# EAGLE design RCM-Comm_v3_E (EAGLE 9.3.1)
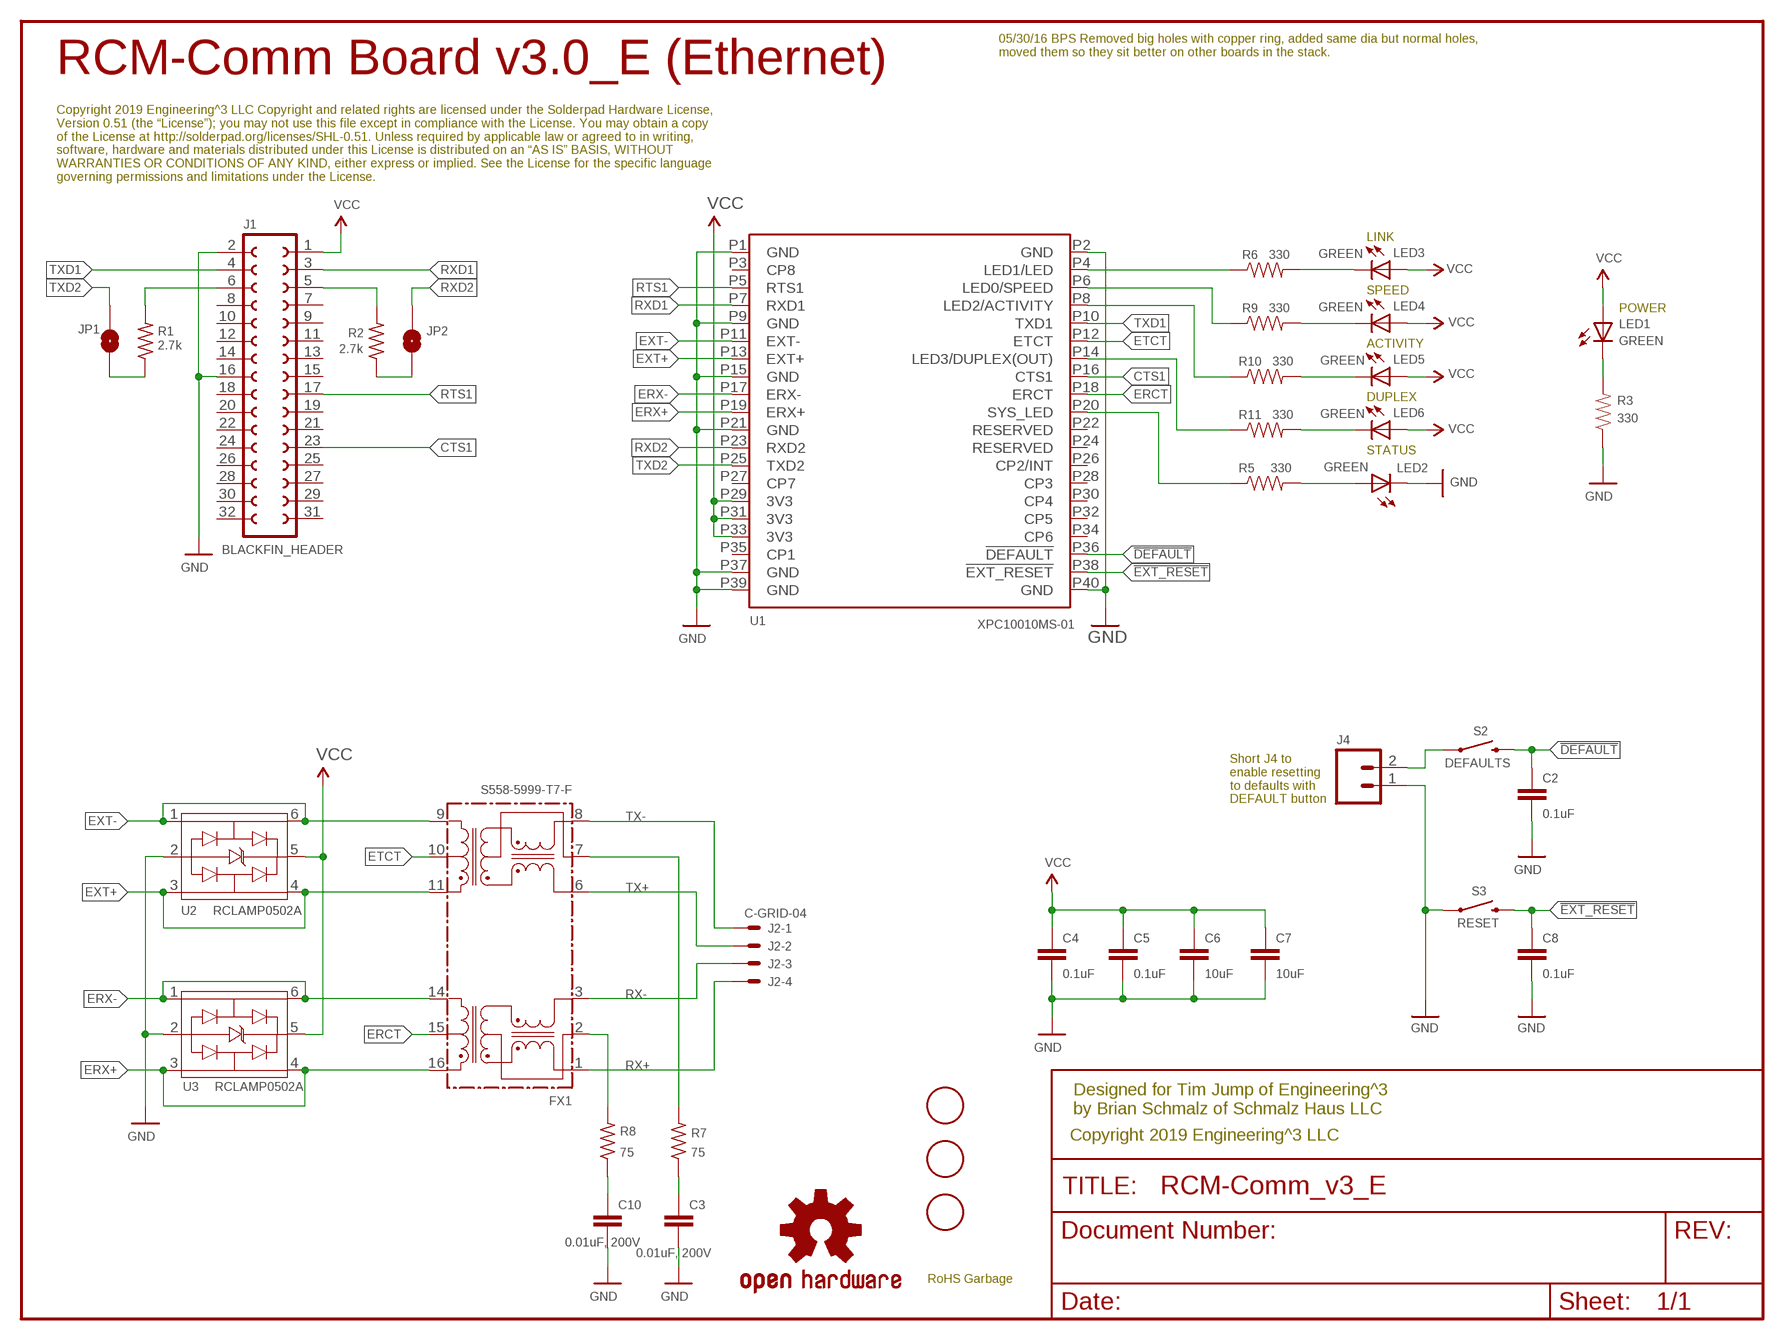
[diagram p0: schematic, sheet 1]

## Parts
C2  0.1uF  0.1UF-25V(+80/-20%)(0603)  [0603-CAP]
C3  0.01uF, 200V  CAP0603-CAP  [0603-CAP]
C4  0.1uF  0.1UF-25V(+80/-20%)(0603)  [0603-CAP]
C5  0.1uF  0.1UF-25V(+80/-20%)(0603)  [0603-CAP]
C6  10uF  10UF-6.3V-20%(0603)  [0603-CAP]
C7  10uF  10UF-6.3V-20%(0603)  [0603-CAP]
C8  0.1uF  0.1UF-25V(+80/-20%)(0603)  [0603-CAP]
C10  0.01uF, 200V  CAP0603-CAP  [0603-CAP]
FID1  FIDUCIAL  [FIDUCIAL_1MM]
FID2  FIDUCIAL  [FIDUCIAL_1MM]
FID3  FIDUCIAL  [FIDUCIAL_1MM]
FX1  S558-5999-T7-F  TG110-E050N5  [N5]
J1  BLACKFIN_HEADER  [2X16]
J2-  C-GRID-04  [70555-04]
J4  M02LOCK  [1X02_LOCK]
JP1  JUMPER-PAD-2-NOROUND  [PAD-JUMPER-2-NO_YES_SILK_ROUND]
JP2  JUMPER-PAD-2-NOROUND  [PAD-JUMPER-2-NO_YES_SILK_ROUND]
LED1  GREEN  LED0603  [LED-0603]
LED2  GREEN  LED0603  [LED-0603]
LED3  GREEN  LED0603  [LED-0603]
LED4  GREEN  LED0603  [LED-0603]
LED5  GREEN  LED0603  [LED-0603]
LED6  GREEN  LED0603  [LED-0603]
LOGO1  OSHW-LOGOM  [OSHW-LOGO-M]
R1  2.7k  R-US_R0603  [R0603]
R2  2.7k  R-US_R0603  [R0603]
R3  330  RESISTOR0603-RES  [0603-RES]
R5  330  RESISTOR0603-RES  [0603-RES]
R6  330  RESISTOR0603-RES  [0603-RES]
R7  75  R-US_R0603  [R0603]
R8  75  R-US_R0603  [R0603]
R9  330  RESISTOR0603-RES  [0603-RES]
R10  330  RESISTOR0603-RES  [0603-RES]
R11  330  RESISTOR0603-RES  [0603-RES]
S2  DEFAULTS  SWITCH-MOMENTARY-2SMD  [TACTILE-SWITCH-SMD]
S3  RESET  SWITCH-MOMENTARY-2SMD  [TACTILE-SWITCH-SMD]
U1  XPC10010MS-01  LANTRONIX_XPICO  [LANTRONIX_XPICO]
U2  RCLAMP0502A  [SC-89]
U3  RCLAMP0502A  [SC-89]
U$3  ROHS_GARBAGE  [ROHS_GARBAGE_5MM]

## Nets
!DEFAULT!: C2.1 S2.3 U1.P36(!DEFAULT!)
!EXT_RESET!: C8.1 S3.3 U1.P38(!EXT_RESET!)
CTS1: J1.23(GP6) U1.P16(CTS1)
ERCT: FX1.15 U1.P18(ERCT)
ERX+: FX1.16 U1.P19(ERX+) U3.3 U3.4
ERX-: FX1.14 U1.P17(ERX-) U3.1 U3.6
ETCT: FX1.10 U1.P12(ETCT)
EXT+: FX1.11 U1.P13(EXT+) U2.3 U2.4
EXT-: FX1.9 U1.P11(EXT-) U2.1 U2.6
GND: C2.2 C3.2 C4.2 C5.2 C6.2 C7.2 C8.2 C10.2 J1.2(GND) J1.16(GND16) J4.1 LED2.C R3.1 S3.1 U1.P1(GND) U1.P2(GND) U1.P9(GND) U1.P15(GND) U1.P21(GND) U1.P37(GND) U1.P39(GND) U1.P40(GND) U2.2 U3.2
LED0_SPEED: R9.1 U1.P6(LED0/SPEED)
LED1_LINK: R6.1 U1.P4(LED1/LED)
LED2_ACTIVITY: R10.1 U1.P8(LED2/ACTIVITY)
LED3_DUPLEX: R11.1 U1.P14(LED3/DUPLEX(OUT))
N$1: J4.2 S2.1
N$2: JP1.2 R1.1
N$3: LED1.C R3.2
N$4: JP2.1 R2.1
N$6: LED2.A R5.2
N$7: FX1.2 R8.2
N$8: LED3.C R6.2
N$9: C10.1 R8.1
N$10: C3.1 R7.1
N$11: FX1.7 R7.2
N$14: LED6.C R11.2
N$15: LED5.C R10.2
N$16: LED4.C R9.2
RTS1: J1.17(GP0) U1.P5(RTS1)
RX+: FX1.1 J2-.4
RX-: FX1.3 J2-.3
RXD1: J1.3(TX0) U1.P7(RXD1)
RXD2: JP2.2 U1.P23(RXD2)
RXD2_J1: J1.5(TX1) R2.2
SYSTEM_LED: R5.1 U1.P20(SYS_LED)
TX+: FX1.6 J2-.2
TX-: FX1.8 J2-.1
TXD1: J1.4(RX0) U1.P10(TXD1)
TXD2: JP1.1 U1.P25(TXD2)
TXD2_J1: J1.6(RX1) R1.2
VCC: C4.1 C5.1 C6.1 C7.1 J1.1(3.3V) LED1.A LED3.A LED4.A LED5.A LED6.A U1.P29(3V3) U1.P31(3V3) U1.P33(3V3) U2.5 U3.5
Unconnected: J1.7(TMR2) J1.8(TMR3) J1.9(SPI_MOSI) J1.10(SPI_MISO) J1.11(SPI_SCK) J1.12(SPI_SEL) J1.13(SPI_SEL2) J1.14(SPI_SCL) J1.15(I2C_SDA) J1.18(GP1) J1.19(GP2) J1.20(GP3) J1.21(GP4) J1.22(GP5) J1.24(GP7) J1.25(GP8) J1.26(GP9) J1.27(GPA) J1.28(GPB) J1.29(GPC) J1.30(GPD) J1.31(GPE) J1.32(GPF) U1.P3(CP8) U1.P22(RESERVED) U1.P24(RESERVED) U1.P26(CP2/INT) U1.P27(CP7) U1.P28(CP3) U1.P30(CP4) U1.P32(CP5) U1.P34(CP6) U1.P35(CP1)

## Notes on the sheet
- 05/30/16 BPS Removed big holes with copper ring, added same dia but normal holes, 
  moved them so they sit better on other boards in the stack.
- RCM-Comm Board v3.0_E (Ethernet)
- Copyright 2019 Engineering^3 LLC Copyright and related rights are licensed under the Solderpad Hardware License, 
  Version 0.51 (the “License”); you may not use this file except in compliance with the License. You may obtain a copy 
  of the License at http://solderpad.org/licenses/SHL-0.51. Unless required by applicable law or agreed to in writing, 
  software, hardware and materials distributed under this License is distributed on an “AS IS” BASIS, WITHOUT 
  WARRANTIES OR CONDITIONS OF ANY KIND, either express or implied. See the License for the specific language 
  governing permissions and limitations under the License.
- LINK
- SPEED
- POWER
- ACTIVITY
- DUPLEX
- STATUS
- Short J4 to
  enable resetting
  to defaults with 
  DEFAULT button
- Designed for Tim Jump of Engineering^3
  by Brian Schmalz of Schmalz Haus LLC
- Copyright 2019 Engineering^3 LLC

## Library data of the parts
C2 C4 C5 C8 = SparkFun-Capacitors:0.1UF-25V(+80/-20%)(0603): CAP-00810 Ceramic Standard decoupling cap; PROD_ID: CAP-00810
C3 C10 = spark_fun:CAP: Capacitor Standard 0603 ceramic capacitor, and 0.1" leaded capacitor.
C6 C7 = SparkFun-Capacitors:10UF-6.3V-20%(0603): CAP-11015; PROD_ID: CAP-11015
FID1-FID3 = adafruit:FIDUCIAL: For use by pick and place machines to calibrate the vision/machine, 1mm By microbuilder.eu
FX1 = halo-electronics:TG110-E050N5: E-Ultra (TM) 10/100BASE-TX SOIC-16 Fast Ethernet Magnetic Modules Source: www.haloelectronics.com .. e-ultra.pdf
J1 = Surveyor:BLACKFIN_HEADER
J2- = MolexConnector:C-GRID-04
J4 = SparkFun-Connectors:M02: Standard 2-pin 0.1" header. Use with - straight break away headers ( PRT-00116) - right angle break away headers (PRT-00553) - swiss pins (PRT-00743) - machine pins (PRT-00117) - female headers (PRT-00115) Molex polarized connector foot print use with: PRT-08233 with associated crimp pins and housings. 2.54_SCREWTERM for use with PRT-10571. 3.5mm Screw Terminal footprints for PRT-08084 5mm Screw Terminal footprints for use with PRT-08432
JP1 JP2 = SparkFun-Passives:JUMPER-PAD-2-NO
LED1-LED6 = spark_fun:LED: LEDs Standard schematic elements and footprints for 5mm, 3mm, 1206, and 0603 sized LEDs. 5mm - Spark Fun Electronics SKU : COM-00529 (and others)
LOGO1 = SparkFun-Aesthetics:OSHW-LOGO: Open Source Hardware Logo This logo indicates the piece of hardware it is found on incorporates a OSHW license and/or adheres to the definition of open source hardware found here: http://freedomdefined.org/OSHW
R1 R2 R7 R8 = rcl:R-US_: RESISTOR, American symbol
R3 R5 R6 R9-R11 = spark_fun:RESISTOR: Resistor Basic schematic elements and footprints for 0603, 1206, and PTH resistors.
S2 S3 = SparkFun-Electromechanical:SWITCH-MOMENTARY-2: Various NO switches- pushbuttons, reed, etc; PROD_ID: SWCH-08247
U1 = xPicoEthernet:LANTRONIX_XPICO
U2 U3 = SemtechRCLAMP:RCLAMP0502A
U$3 = SchmalzHausPublic:ROHS_GARBAGE

## Board
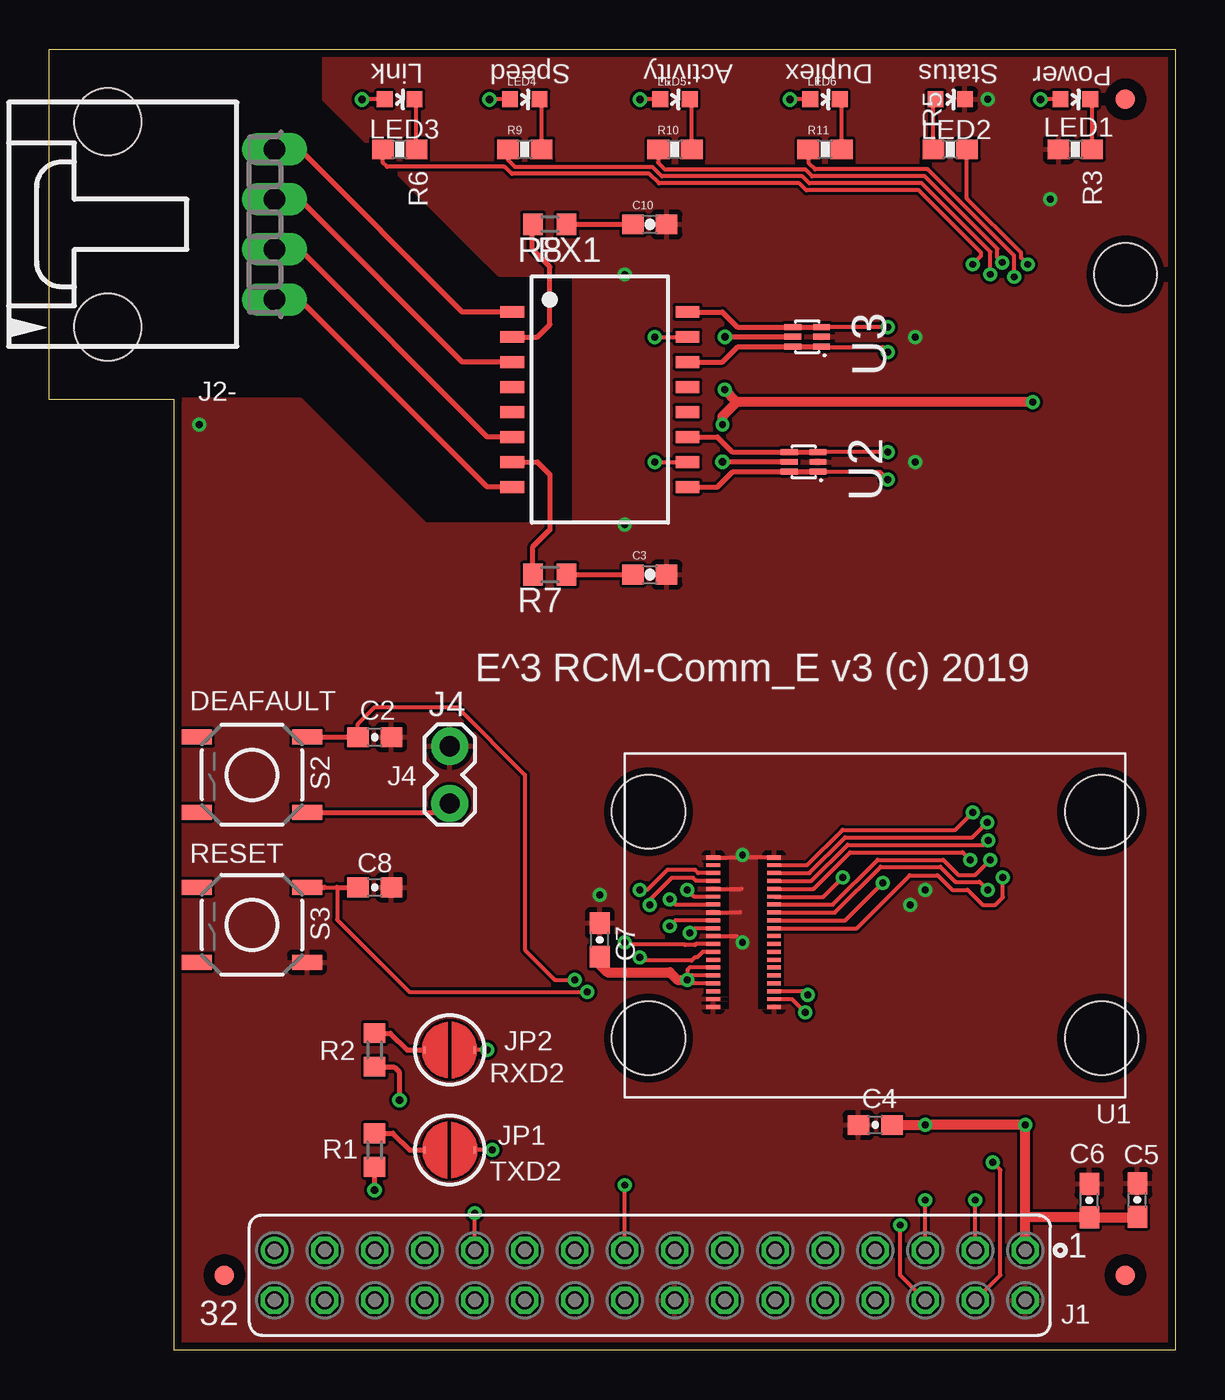
[diagram p1: board, top side]
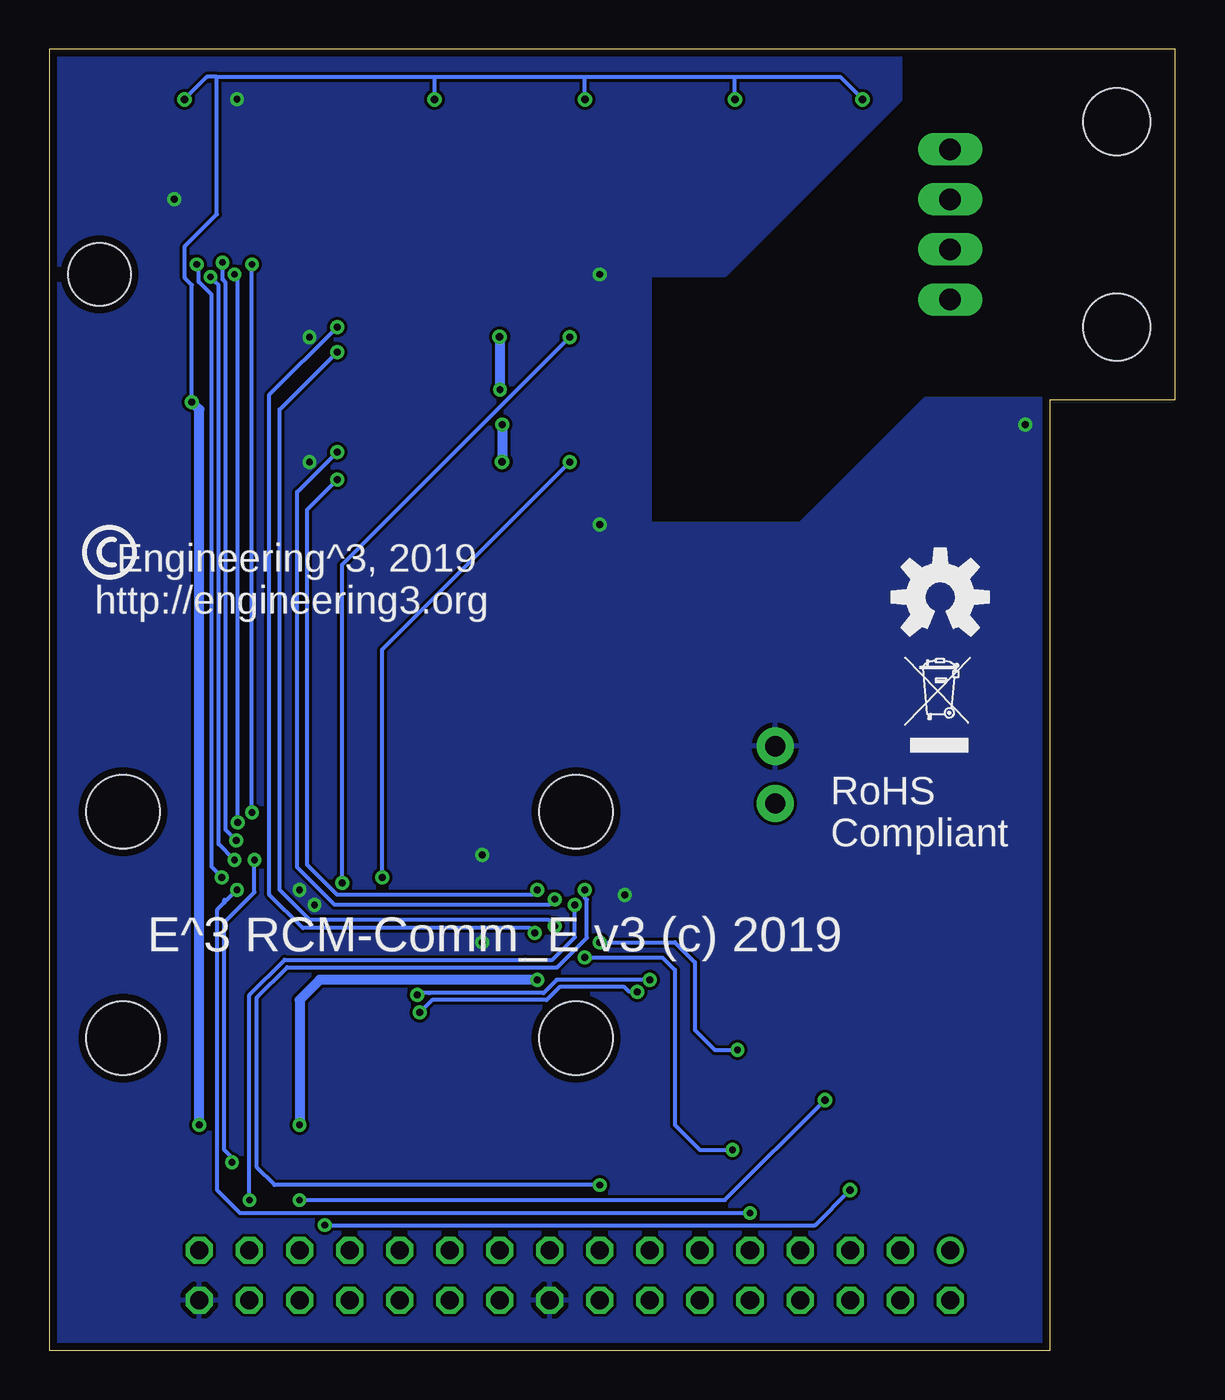
[diagram p2: board, bottom side, seen from below]

Size 57.15 x 66.05 mm. Coordinates in mm from the lower left corner, seen from the top.
Outline: 0,66.05 57.15,66.05 57.15,43.69 57.15,0 6.35,0.01 6.35,48.27 0,48.27 0,66.05
Copper layers (1*16): Top 0.0356mm / dielectric 1.5011mm / Bottom 0.0356mm
Design rules "LaenPCBOrder": minimum track width 6mil, minimum drill 13mil, track to track 6mil, track to pad 6mil, pad to pad 6mil, via to via 6mil, smd to smd 6mil, copper to edge 15mil, drill to drill 6mil, minimum pad ring 7mil, minimum via ring 7mil, stop-mask expansion 3mil, vias tented up to drill 25mil, thermal gap 10mil
Holes 3.17 mm at 54.61,54.62

### Footprints (pad centres in the part's own frame; a part is rotated, then mirrored left to right if it is on the bottom)
0603-CAP = smd 1.1 x 1: 1 -0.85,0; 2 0.85,0
FIDUCIAL_1MM = smd 1 x 1: 1 0,0
N5 = smd 0.6 x 1.2: 1 -4.445,-4.445; 2 -3.175,-4.445; 3 -1.905,-4.445; 4 -0.635,-4.445; 5 0.635,-4.445; 6 1.905,-4.445; 7 3.175,-4.445; 8 4.445,-4.445; 9 4.445,4.445; 10 3.175,4.445; 11 1.905,4.445; 12 0.635,4.445; 13 -0.635,4.445; 14 -1.905,4.445; 15 -3.175,4.445; 16 -4.445,4.445
2X16 = drill 0.914 octagon: 1 20.32,1.27; 2 20.32,-1.27; 3 17.78,1.27; 4 17.78,-1.27; 5 15.24,1.27; 6 15.24,-1.27; 7 12.7,1.27; 8 12.7,-1.27; 9 10.16,1.27; 10 10.16,-1.27; 11 7.62,1.27; 12 7.62,-1.27; 13 5.08,1.27; 14 5.08,-1.27; 15 2.54,1.27; 16 2.54,-1.27; 17 0,1.27; 18 0,-1.27; 19 -2.54,1.27; 20 -2.54,-1.27; 21 -5.08,1.27; 22 -5.08,-1.27; 23 -7.62,1.27; 24 -7.62,-1.27; 25 -10.16,1.27; 26 -10.16,-1.27; 27 -12.7,1.27; 28 -12.7,-1.27; 29 -15.24,1.27; 30 -15.24,-1.27; 32 -17.78,-1.27 | drill 0.914: 31 -17.78,1.27
70555-04 = drill 1.092 long: 1 -3.81,0; 2 -1.27,0; 3 1.27,0; 4 3.81,0 | hole 3.404: -5.207,8.458; 5.207,8.458
1X02_LOCK = drill 1.016 pad 1.88: 1 -0.178,0; 2 2.718,0
PAD-JUMPER-2-NO_YES_SILK_ROUND = smd 0.152 x 0.305: 1 -1.27,0; 2 1.27,0
LED-0603 = smd 0.8 x 0.8: A 0,-0.75; C 0,0.75
R0603 = smd 1 x 1.1: 1 -0.85,0; 2 0.85,0
0603-RES = smd 1.1 x 1: 1 -0.85,0; 2 0.85,0
TACTILE-SWITCH-SMD = smd 1.524 x 0.762: 1 -2.794,1.905; 2 2.794,1.905; 3 -2.794,-1.905; 4 2.794,-1.905
LANTRONIX_XPICO = smd 0.7 x 0.2: P1 -8.21,3.43; P2 -5.13,3.43; P3 -8.21,3.03; P4 -5.13,3.03; P5 -8.21,2.63; P6 -5.13,2.63; P7 -8.21,2.23; P8 -5.13,2.23; P9 -8.21,1.83; P10 -5.13,1.83; P11 -8.21,1.43; P12 -5.13,1.43; P13 -8.21,1.03; P14 -5.13,1.03; P15 -8.21,0.63; P16 -5.13,0.63; P17 -8.21,0.23; P18 -5.13,0.23; P19 -8.21,-0.17; P20 -5.13,-0.17; P21 -8.21,-0.57; P22 -5.13,-0.57; P23 -8.21,-0.97; P24 -5.13,-0.97; P25 -8.21,-1.37; P26 -5.13,-1.37; P27 -8.21,-1.77; P28 -5.13,-1.77; P29 -8.21,-2.17; P30 -5.13,-2.17; P31 -8.21,-2.57; P32 -5.13,-2.57; P33 -8.21,-2.97; P34 -5.13,-2.97; P35 -8.21,-3.37; P36 -5.13,-3.37; P37 -8.21,-3.77; P38 -5.13,-3.77; P39 -8.21,-4.17; P40 -5.13,-4.17 | hole 3.73: -11.5,5.75; -11.5,-5.75; 11.5,5.75; 11.5,-5.75
SC-89 = smd 0.3 x 0.85: 1 -0.5,-0.725; 2 0,-0.725; 3 0.5,-0.725; 4 0.5,0.725; 5 0,0.725; 6 -0.5,0.725

### Placement (x,y rotation side)
C2  16.51,31.12 0 top
C3  30.48,39.38 0 top
C4  41.91,11.44 180 top
C5  55.22,7.62 90 top
C6  52.78,7.6 90 top
C7  27.94,20.83 90 top
C8  16.51,23.5 0 top
C10  30.48,57.16 0 top
FID1  8.89,3.81 0 top
FID2  54.61,63.51 0 top
FID3  54.61,3.81 0 top
FX1  27.94,48.27 270 top
J1  29.21,3.81 0 top
J2-  11.43,57.16 90 top
J4  20.32,30.48 270 top
JP1  20.32,10.17 180 top
JP2  20.32,15.25 0 top
LED1  52.07,63.51 270 top
LED2  45.72,63.51 270 top
LED3  17.78,63.51 270 top
LED4  24.13,63.51 270 top
LED5  31.75,63.51 270 top
LED6  39.37,63.51 270 top
LOGO1  11.94,38.23 0 bottom
R1  16.51,10.17 270 top
R2  16.51,15.25 270 top
R3  52.07,60.97 0 top
R5  45.72,60.97 180 top
R6  17.78,60.97 0 top
R7  25.4,39.38 180 top
R8  25.4,57.16 180 top
R9  24.13,60.97 0 top
R10  31.75,60.97 0 top
R11  39.37,60.97 0 top
S2  10.29,29.21 180 top
S3  10.29,21.59 180 top
U1  41.91,21.59 0 top
U2  38.28,45.1 90 top
U3  38.46,51.45 90 top
U$3  13.72,30.36 0 bottom

### Tracks (layer width: path | path; a pad name or v marks a point on that pad's centre or on a via)
!DEFAULT!  (via drill 0.35)
  Top 0.203: U1.P36 38.29,18.22 v38.47,18.04 v38.48,18.04 | C2.1 15.66,31.79 16.51,32.64 20.7,32.64 24.13,29.21 24.13,20.32 25.65,18.8 v26.67,18.8
  Top 0.254: S2.3 C2.1
  Bottom 0.203: v38.48,18.04 38.45,18.07 38.45,18.14 37.87,18.14 32.06,18.14 31.4,18.8 v26.67,18.8
!EXT_RESET!  (via drill 0.35)
  Top 0.203: U1.P38 37.68,17.82 v38.35,17.15 | 13.97,23.5 14.61,23.5 14.61,21.85 18.26,18.19 v27.3,18.19
  Top 0.254: S3.3 13.97,23.5 | 14.61,23.5 C8.1
  Bottom 0.203: v38.35,17.15 37.72,17.79 31.92,17.79 31.26,18.45 27.96,18.45 27.71,18.19 v27.3,18.19
CTS1  (via drill 0.35)
  Top 0.203: U1.P16 39.87,22.22 42.18,24.54 45.22,24.54 45.98,23.78 47.22,23.78 v47.62,23.37 | J1.23 v21.59,6.96
  Bottom 0.203: v47.62,23.37 48.13,22.86 48.26,22.86 48.26,22.73 48.62,22.38 48.62,8.11 47.47,6.96 v21.59,6.96
ERCT  (via drill 0.35)
  Top 0.203: U1.P18 40.39,21.82 v42.29,23.73 | v30.73,51.44 FX1.15
  Bottom 0.203: v42.29,23.73 42.29,39.88 v30.73,51.44
ERX+  (via drill 0.35)
  Top 0.203: U1.P19 32.76,21.43 v32.51,21.18 | v42.55,51.95 U3.3
  Top 0.254: FX1.16 34.16,52.71 34.92,51.95 U3.4 U3.3
  Bottom 0.203: v32.51,21.18 32.76,21.43 44.28,21.43 45.97,23.12 45.97,48.52 v42.55,51.95
ERX-  (via drill 0.35)
  Top 0.203: U1.P17 31.79,21.82 v31.5,21.53 | v42.55,50.68 42.29,50.93 39.2,50.93 U3.1
  Top 0.254: FX1.14 34.16,50.17 34.94,50.95 U3.6 U3.1
  Bottom 0.203: v31.5,21.53 31.81,21.85 43.94,21.85 45.47,23.37 45.47,47.76 v42.55,50.68
ETCT  (via drill 0.35)
  Top 0.203: U1.P12 39.28,23.02 v40.26,24.01 | v30.73,45.09 FX1.10
  Bottom 0.203: v40.26,24.01 40.26,35.57 v30.73,45.09
EXT+  (via drill 0.35)
  Top 0.203: v42.55,45.6 U2.3 | v31.5,22.9 31.77,22.62 U1.P13
  Top 0.254: FX1.11 33.91,46.36 34.67,45.6 U2.4 U2.3
  Bottom 0.203: v31.5,22.9 31.78,22.61 42.67,22.61 44.58,24.52 44.58,43.57 v42.55,45.6
EXT-  (via drill 0.35)
  Top 0.203: U1.P11 32.73,23.02 v32.38,23.37 | v42.55,44.2 42.16,44.58 39.02,44.58 U2.1
  Top 0.254: FX1.9 33.91,43.82 34.69,44.6 U2.6 U2.1
  Bottom 0.203: v32.38,23.37 32.64,23.12 42.55,23.12 44.07,24.64 44.07,42.68 v42.55,44.2
GND  (via drill 0.35)
  Top 0.203: U1.P21 34.86,21.02 | U1.P1 34.92,25.02 | U1.P2 35.43,25.02 | U1.P9 35.13,23.43 | U1.P15 35.05,22.22 35.05,22.23
  other vias: 50.8,58.43 29.21,54.62 29.21,41.91 7.62,47 47.62,63.51 43.94,51.44 43.94,45.09 43.69,22.61 44.45,23.37 35.18,25.15 35.18,20.71 27.94,23.12
  pour Top: 13.97,66.05 57.15,66.05 57.15,0.01 6.35,0.01 6.35,48.27 12.7,48.27 19.05,41.91 26.67,41.91 26.67,54.62 22.86,54.62 13.97,63.51
  pour Bottom: 19.05,41.91 26.67,41.91 26.67,54.62 22.86,54.62 13.97,63.51 13.97,66.05 57.15,66.05 57.15,0.01 6.35,0.01 6.35,48.27 12.7,48.27
LED0_SPEED  (via drill 0.35)
  Top 0.203: U1.P6 38.57,24.22 40.39,26.04 46.83,26.04 47.34,26.55 | R9.1 23.28,60.42 23.62,60.08 30.61,60.08 31.09,59.59 38.21,59.59 38.57,59.24 44.28,59.24 47.75,55.77 v47.75,54.62 | 47.34,26.55 | 47.34,26.55 v47.59,26.8
  Bottom 0.203: v47.59,26.8 47.59,54.46 v47.75,54.62
LED1_LINK  (via drill 0.35)
  Top 0.203: U1.P4 38.46,24.62 40.26,26.42 45.98,26.42 v46.86,27.3 v46.86,27.31 | R6.1 16.93,60.29 17.14,60.08 23.11,60.08 23.47,59.72 30.46,59.72 30.94,59.24 38.07,59.24 38.42,58.88 44.14,58.88 47.3,55.72 47.3,55.55 v46.86,55.12
  Bottom 0.203: v46.86,27.31 v46.86,55.12
LED2_ACTIVITY  (via drill 0.35)
  Top 0.203: R10.1 30.9,60.29 31.24,59.95 38.36,59.95 38.72,59.59 44.43,59.59 48.11,55.91 48.11,55.47 v48.36,55.22 | U1.P8 38.67,23.82 40.51,25.66 47.44,25.66 v47.66,25.88
  Bottom 0.203: v47.66,25.88 | v47.66,25.88 48.2,26.42 48.2,54.21 48.36,54.36 48.36,54.87 48.33,54.9 48.33,55.19 v48.36,55.22
LED3_DUPLEX  (via drill 0.35)
  Top 0.203: R11.1 38.52,60.29 38.86,59.95 44.58,59.95 48.97,55.56 v48.97,54.49 | U1.P14 39.77,22.62 42.04,24.9 45.36,24.9 46.13,24.13 46.99,24.13 v47.75,24.9
  Bottom 0.203: v47.75,24.9 48.56,25.7 48.56,54.06 48.71,54.22 48.71,54.24 v48.97,54.49
N$1
  Top 0.254: S2.1 19.94,27.31 20.4,27.77 J4.2
N$2
  Top 0.254: R1.1 17.44,11.02 18.29,10.17 JP1.2
N$3
  Top 0.203: R3.2 52.92,63.41 LED1.C
N$4
  Top 0.254: R2.1 17.31,16.09 18.16,15.25 JP2.1
N$6
  Top 0.203: R5.2 44.87,63.41 LED2.A
N$7
  Top 0.254: FX1.2 24.76,51.44 25.4,52.08 25.4,55 24.51,55.89 24.51,57.12 R8.2
N$8
  Top 0.203: R6.2 18.63,63.41 LED3.C
N$9
  Top 0.254: R8.1 C10.1
N$10
  Top 0.254: R7.1 C3.1
N$11
  Top 0.254: FX1.7 24.76,45.09 25.4,44.46 25.4,41.66 24.51,40.77 24.51,39.41 R7.2
N$14
  Top 0.203: R11.2 40.22,63.41 LED6.C
N$15
  Top 0.203: R10.2 32.6,63.41 LED5.C
N$16
  Top 0.203: R9.2 24.98,63.41 LED4.C
RTS1  (via drill 0.35)
  Top 0.203: U1.P5 32.93,24.22 32.77,24.39 31.37,24.39 30.35,23.37 v29.97,23.37 | J1.17 v29.21,8.39
  Bottom 0.203: v29.21,8.39 45.72,8.39 46.61,9.28 46.61,17.91 45.09,19.44 31.37,19.44 29.87,20.94 29.87,22.86 29.97,22.96 v29.97,23.37
RX+
  Top 0.254: J2-.4 12.7,60.97 20.95,52.71 FX1.1
RX-
  Top 0.254: FX1.3 20.95,50.17 12.7,58.43 J2-.3
RXD1  (via drill 0.35)
  Top 0.203: U1.P7 32.82,23.82 32.67,23.98 31.59,23.98 30.48,22.86 v30.48,22.61 | J1.3 v46.99,7.62
  Bottom 0.203: v30.48,22.61 30.48,20.96 31.62,19.82 33.02,19.82 45.21,19.82 46.99,18.04 v46.99,7.62
RXD2  (via drill 0.35)
  Top 0.203: v22.22,15.25 JP2.2 | U1.P23 32.82,20.62 32.76,20.57 32.26,20.57 32.21,20.62 29.29,20.62 v29.21,20.71
  Bottom 0.203: v29.21,20.71 25.4,20.71 24.38,19.69 24.38,16.26 23.37,15.25 v22.22,15.25
RXD2_J1  (via drill 0.35, 0.38)
  Top 0.203: J1.5 v44.45,7.62
  Top 0.254: v17.78,12.71 17.78,14.1 17.53,14.36 16.64,14.36 16.51,14.48 R2.2
  Bottom 0.203: v44.45,7.62 22.86,7.62 v17.78,12.71
SYSTEM_LED  (via drill 0.35)
  Top 0.203: R5.1 46.57,58.46 49.32,55.71 49.32,55.46 v49.66,55.12 | U1.P20 40.98,21.43 43.66,24.11 45.08,24.11 45.82,23.37 46.61,23.37 47.37,22.61 48.01,22.61 48.39,22.99 v48.39,24.01
  Bottom 0.203: v48.39,24.01 48.91,24.54 48.91,53.58 49.57,54.24 49.57,55.04 v49.66,55.12
TX+
  Top 0.254: FX1.6 22.22,46.36 12.7,55.89 J2-.2
TX-
  Top 0.254: FX1.8 22.22,43.82 12.7,53.35 J2-.1
TXD1  (via drill 0.35)
  Top 0.203: U1.P10 38.79,23.43 40.64,25.28 46.36,25.28 v46.74,24.9 | J1.4 48.26,3.81 48.26,9.15 v47.88,9.53
  Bottom 0.203: v46.74,24.9 46.74,23.25 48.26,21.72 48.26,10.17 47.88,9.78 v47.88,9.53
TXD2  (via drill 0.35)
  Top 0.203: U1.P25 33.17,20.22 32.89,19.94 32.77,19.94 32.6,19.78 30.13,19.78 v29.97,19.94 | v22.48,10.17 JP1.1
  Bottom 0.203: v22.48,10.17 24.13,10.17 25.4,11.44 25.4,19.31 26.03,19.94 v29.97,19.94
TXD2_J1  (via drill 0.35, 0.38)
  Top 0.203: J1.6 43.18,3.81 v43.18,6.35
  Top 0.254: v16.51,8.13 R1.2
  Bottom 0.203: v43.18,6.35 18.29,6.35 v16.51,8.13
VCC  (via drill 0.35, 0.38)
  Top 0.203: LED5.A v29.97,63.51 | LED4.A v22.35,63.51 | LED3.A v15.88,63.51 | LED6.A v37.59,63.51 | LED1.A v50.29,63.51 | 27.94,19.56 C7.1 | 32.38,18.93 32.38,19.31 32.5,19.43 U1.P29 | 32.38,18.93 v32.38,18.8 32.56,18.62 U1.P33 | U1.P31 32.48,19.02 32.38,18.93
  Top 0.254: 55.19,6.75 C5.1 | U3.5 v34.29,51.44 | U2.5 34.17,45.1 v34.16,45.09
  Top 0.508: 55.19,6.75 C6.1 49.64,6.75 49.53,6.86 | v49.91,48.14 34.89,48.14 | 34.89,48.14 v34.27,48.76 | 34.89,48.14 34.16,47.41 v34.16,47 | 27.94,19.56 28.32,19.18 31.5,19.18 31.88,18.8 v32.38,18.8 | C4.1 v44.45,11.44 v49.53,11.44 49.53,6.86 | J1.1 49.53,6.86
  Bottom 0.203: 34.27,51.43 v34.29,51.44 | v49.91,48.14 49.91,54.07 50.26,54.43 50.26,56.04 48.64,57.66 48.64,64.65 | 48.64,64.65 49.15,64.65 v50.29,63.51 | 48.64,64.65 37.59,64.65 | 37.59,64.65 29.97,64.65 | 29.97,64.65 22.35,64.65 | 22.35,64.65 17.02,64.65 v15.88,63.51 | v22.35,63.51 22.35,64.65 | v29.97,63.51 29.97,64.65 | v37.59,63.51 37.59,64.65
  Bottom 0.508: v44.45,11.44 44.45,17.79 43.43,18.8 v32.38,18.8 | v49.53,11.44 49.53,47.76 v49.91,48.14 | v34.27,48.76 34.27,51.43 | v34.16,47 v34.16,45.09

### Text on the board
tPlace: Link | Speed | Activity | Duplex | Status | Power | E^3 RCM-Comm_E v3 (c) 2019 | DEAFAULT | J4 | RESET | RXD2 | TXD2
bPlace: Engineering^3, 2019 / http://engineering3.org | RoHS / Compliant | E^3 RCM-Comm_E v3 (c) 2019